# Altium schematic sheet top.SchDoc
size 420 x 297 mm; SheetNumber: 1; SheetTotal: 7
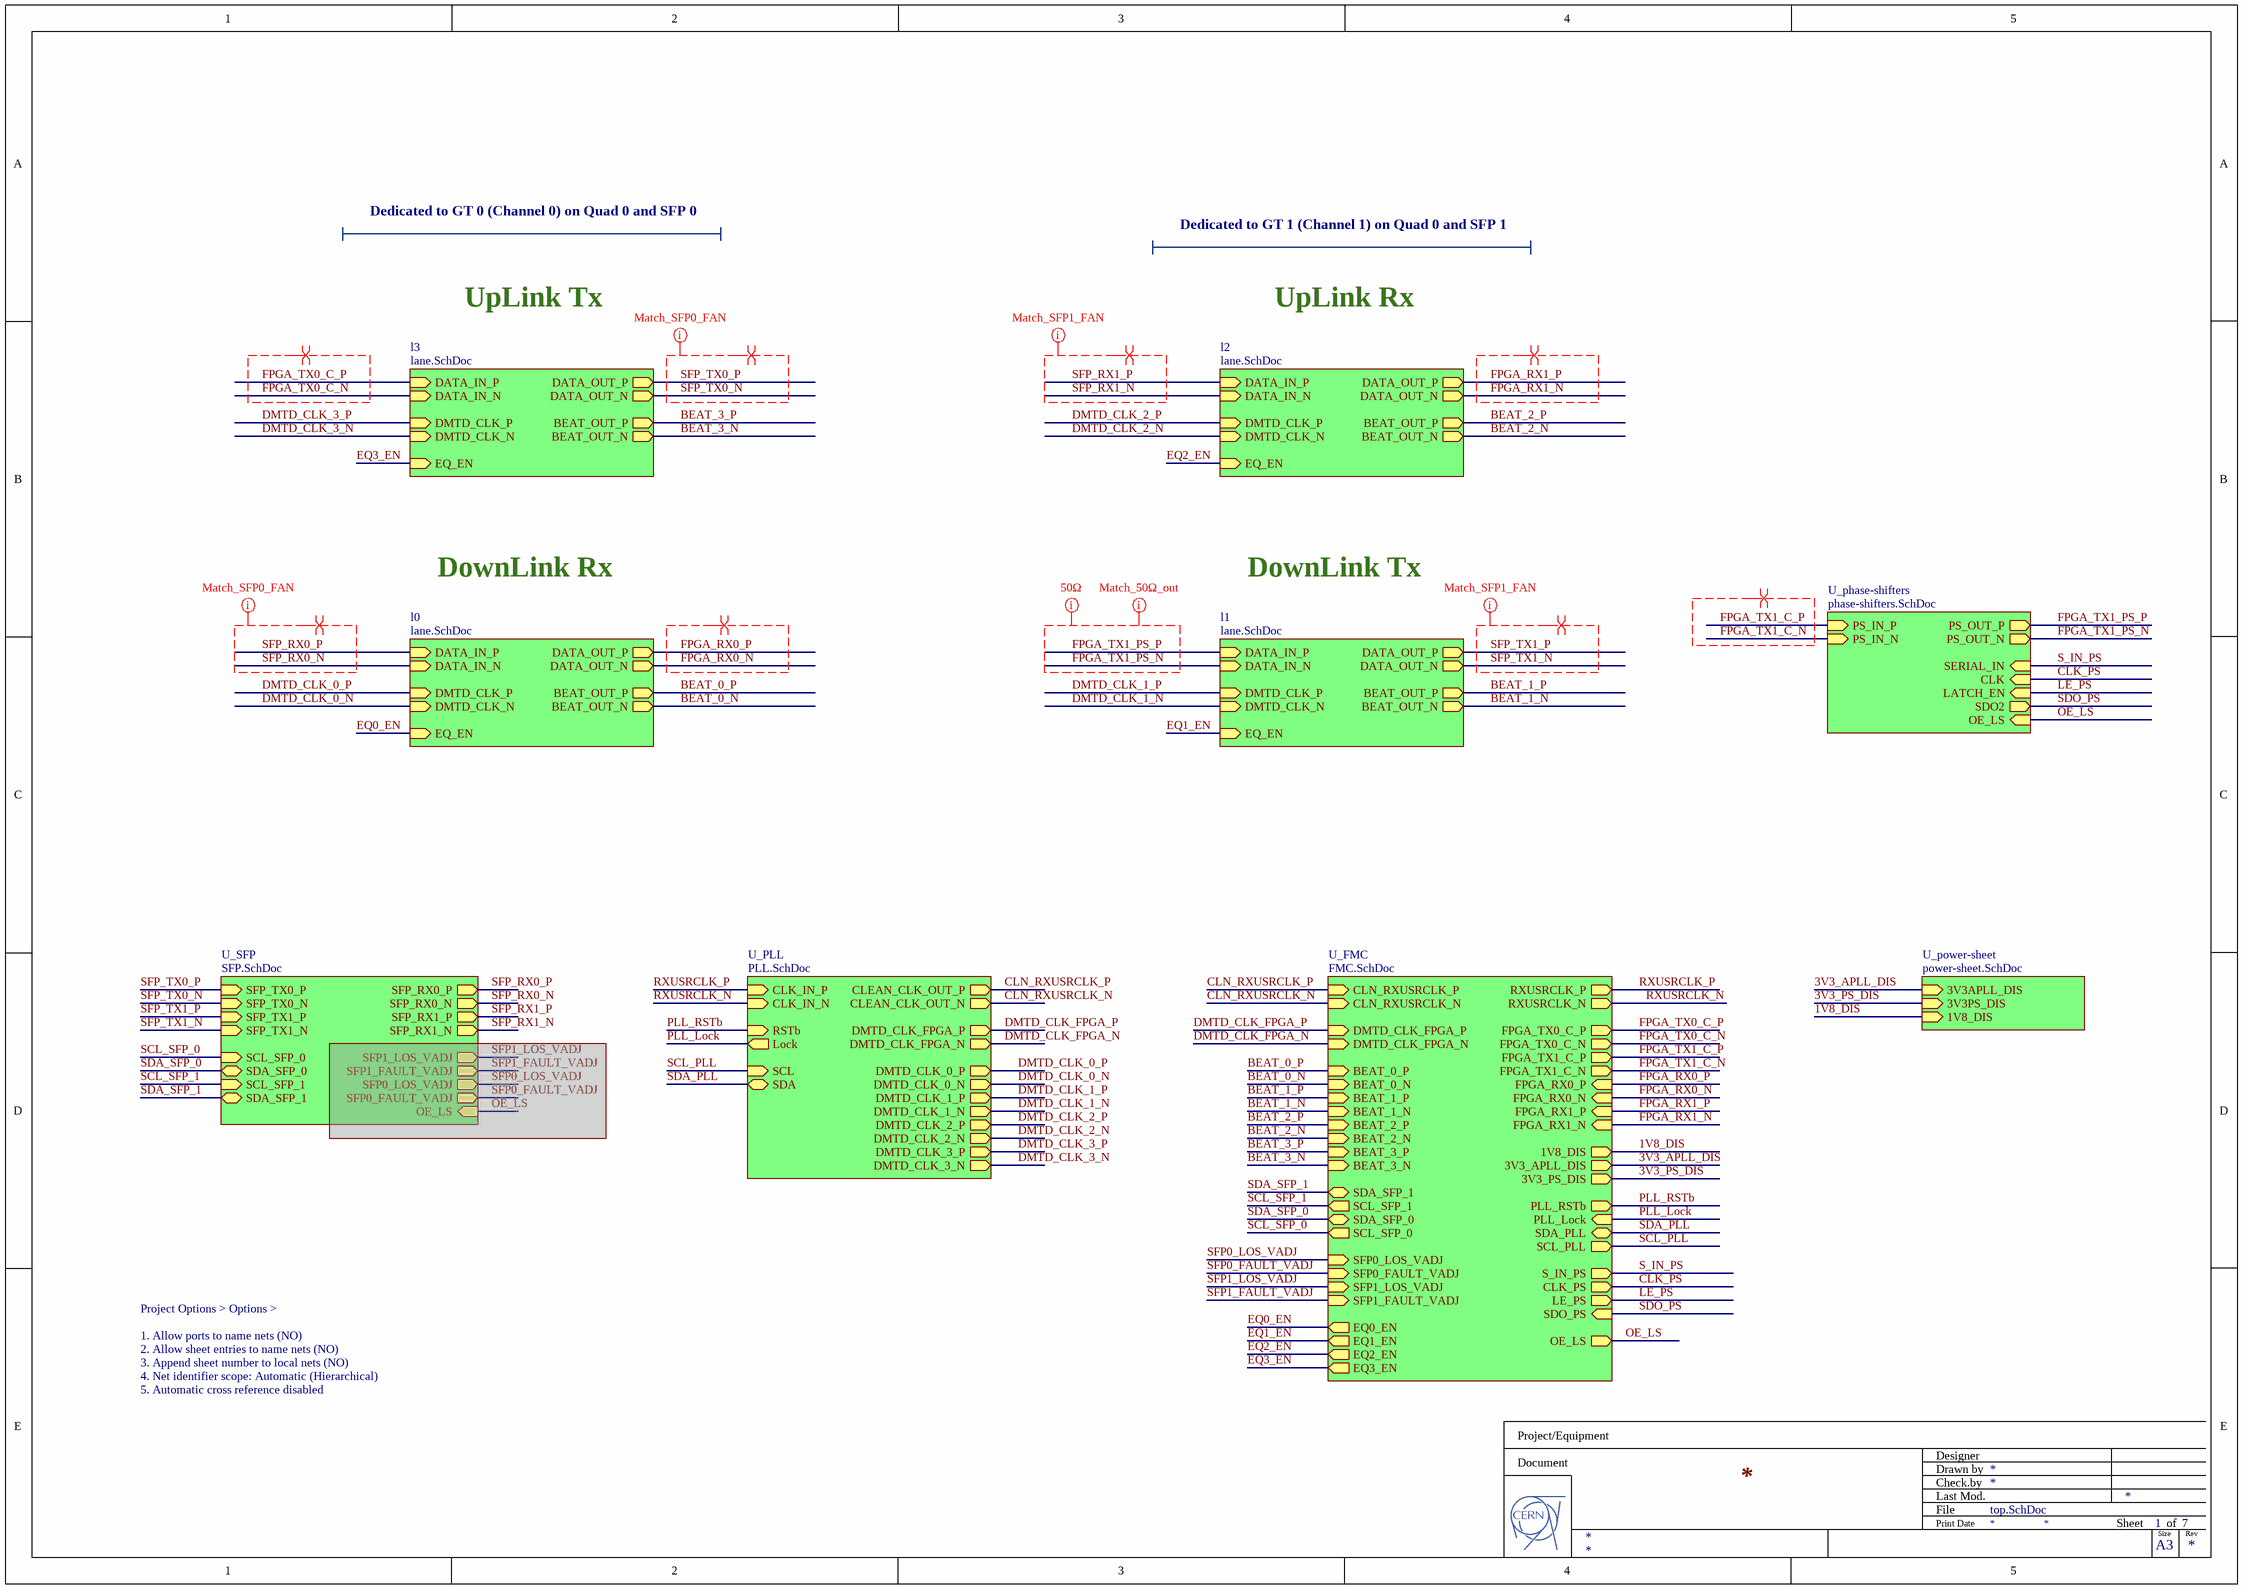
[diagram p0: top.SchDoc]

## Sub-sheets
l0 = lane.SchDoc: DATA_IN_P (in), DATA_IN_N (in), BEAT_OUT_P (out), BEAT_OUT_N (out), DMTD_CLK_P (in), DMTD_CLK_N (in), DATA_OUT_P (out), DATA_OUT_N (out), EQ_EN (in)
l1 = lane.SchDoc: DATA_IN_P (in), DATA_IN_N (in), BEAT_OUT_P (out), BEAT_OUT_N (out), DMTD_CLK_P (in), DMTD_CLK_N (in), DATA_OUT_P (out), DATA_OUT_N (out), EQ_EN (in)
l2 = lane.SchDoc: DATA_IN_P (in), DATA_IN_N (in), BEAT_OUT_P (out), BEAT_OUT_N (out), DMTD_CLK_P (in), DMTD_CLK_N (in), DATA_OUT_P (out), DATA_OUT_N (out), EQ_EN (in)
l3 = lane.SchDoc: DATA_IN_P (in), DATA_IN_N (in), BEAT_OUT_P (out), BEAT_OUT_N (out), DMTD_CLK_P (in), DMTD_CLK_N (in), DATA_OUT_P (out), DATA_OUT_N (out), EQ_EN (in)
U_FMC = FMC.SchDoc: DMTD_CLK_FPGA_N (in), DMTD_CLK_FPGA_P (in), BEAT_3_P (in), BEAT_3_N (in), SCL_PLL (out), SDA_PLL (bidir), SCL_SFP_1 (out), SDA_SFP_1 (bidir), SCL_SFP_0 (out), SDA_SFP_0 (bidir), PLL_Lock (in), SFP0_LOS_VADJ (in), SFP0_FAULT_VADJ (in), SFP1_LOS_VADJ (in), SFP1_FAULT_VADJ (in), CLN_RXUSRCLK_P (in), CLN_RXUSRCLK_N (in), RXUSRCLK_P (out), RXUSRCLK_N (out), PLL_RSTb (out), 1V8_DIS (out), 3V3_APLL_DIS (out), 3V3_PS_DIS (out), FPGA_TX0_C_P (out), FPGA_TX0_C_N (out), FPGA_TX1_C_P (out), FPGA_TX1_C_N (out), FPGA_RX0_P (in), FPGA_RX0_N (in), FPGA_RX1_P (in), FPGA_RX1_N (in), BEAT_0_P (in), BEAT_0_N (in), BEAT_1_P (in), BEAT_1_N (in), BEAT_2_P (in), BEAT_2_N (in), S_IN_PS (out), CLK_PS (out), LE_PS (out), SDO_PS (in), EQ0_EN (out), EQ1_EN (out), EQ2_EN (out), EQ3_EN (out), OE_LS (out)
U_phase-shifters = phase-shifters.SchDoc: PS_IN_P (in), PS_IN_N (in), PS_OUT_P (out), LATCH_EN (in), CLK (in), SERIAL_IN (in), SDO2 (out), PS_OUT_N (out), OE_LS (in)
U_PLL = PLL.SchDoc: SCL (in), SDA (bidir), CLK_IN_P (in), CLK_IN_N (in), CLEAN_CLK_OUT_P (out), CLEAN_CLK_OUT_N (out), DMTD_CLK_0_P (out), DMTD_CLK_0_N (out), DMTD_CLK_1_P (out), DMTD_CLK_1_N (out), DMTD_CLK_2_P (out), DMTD_CLK_2_N (out), DMTD_CLK_FPGA_P (out), DMTD_CLK_FPGA_N (out), DMTD_CLK_3_P (out), DMTD_CLK_3_N (out), Lock (out), RSTb (in)
U_power-sheet = power-sheet.SchDoc: 3V3APLL_DIS (in), 3V3PS_DIS (in), 1V8_DIS (in)
U_SFP = SFP.SchDoc: SFP_RX0_P (out), SFP_RX0_N (out), SFP_TX0_P (in), SFP_TX0_N (in), SFP_RX1_P (out), SFP_RX1_N (out), SFP_TX1_P (in), SFP_TX1_N (in), SCL_SFP_0 (in), SDA_SFP_0 (bidir), SCL_SFP_1 (in), SDA_SFP_1 (bidir), SFP1_LOS_VADJ (out), SFP1_FAULT_VADJ (out), SFP0_LOS_VADJ (out), SFP0_FAULT_VADJ (out), OE_LS (in)

## Nets
1V8_DIS: sheet U_power-sheet/1V8_DIS, sheet U_FMC/1V8_DIS
3V3_APLL_DIS: sheet U_power-sheet/3V3APLL_DIS, sheet U_FMC/3V3_APLL_DIS
3V3_PS_DIS: sheet U_power-sheet/3V3PS_DIS, sheet U_FMC/3V3_PS_DIS
BEAT_0_N: sheet l0/BEAT_OUT_N, sheet U_FMC/BEAT_0_N
BEAT_0_P: sheet l0/BEAT_OUT_P, sheet U_FMC/BEAT_0_P
BEAT_1_N: sheet l1/BEAT_OUT_N, sheet U_FMC/BEAT_1_N
BEAT_1_P: sheet l1/BEAT_OUT_P, sheet U_FMC/BEAT_1_P
BEAT_2_N: sheet l2/BEAT_OUT_N, sheet U_FMC/BEAT_2_N
BEAT_2_P: sheet l2/BEAT_OUT_P, sheet U_FMC/BEAT_2_P
BEAT_3_N: sheet l3/BEAT_OUT_N, sheet U_FMC/BEAT_3_N
BEAT_3_P: sheet l3/BEAT_OUT_P, sheet U_FMC/BEAT_3_P
CLK_PS: sheet U_FMC/CLK_PS, sheet U_phase-shifters/CLK
CLN_RXUSRCLK_N: sheet U_PLL/CLEAN_CLK_OUT_N, sheet U_FMC/CLN_RXUSRCLK_N
CLN_RXUSRCLK_P: sheet U_PLL/CLEAN_CLK_OUT_P, sheet U_FMC/CLN_RXUSRCLK_P
DMTD_CLK_0_N: sheet U_PLL/DMTD_CLK_0_N, sheet l0/DMTD_CLK_N
DMTD_CLK_0_P: sheet U_PLL/DMTD_CLK_0_P, sheet l0/DMTD_CLK_P
DMTD_CLK_1_N: sheet U_PLL/DMTD_CLK_1_N, sheet l1/DMTD_CLK_N
DMTD_CLK_1_P: sheet U_PLL/DMTD_CLK_1_P, sheet l1/DMTD_CLK_P
DMTD_CLK_2_N: sheet U_PLL/DMTD_CLK_2_N, sheet l2/DMTD_CLK_N
DMTD_CLK_2_P: sheet U_PLL/DMTD_CLK_2_P, sheet l2/DMTD_CLK_P
DMTD_CLK_3_N: sheet U_PLL/DMTD_CLK_3_N, sheet l3/DMTD_CLK_N
DMTD_CLK_3_P: sheet U_PLL/DMTD_CLK_3_P, sheet l3/DMTD_CLK_P
DMTD_CLK_FPGA_N: sheet U_PLL/DMTD_CLK_FPGA_N, sheet U_FMC/DMTD_CLK_FPGA_N
DMTD_CLK_FPGA_P: sheet U_PLL/DMTD_CLK_FPGA_P, sheet U_FMC/DMTD_CLK_FPGA_P
EQ0_EN: sheet l0/EQ_EN, sheet U_FMC/EQ0_EN
EQ1_EN: sheet l1/EQ_EN, sheet U_FMC/EQ1_EN
EQ2_EN: sheet l2/EQ_EN, sheet U_FMC/EQ2_EN
EQ3_EN: sheet l3/EQ_EN, sheet U_FMC/EQ3_EN
FPGA_RX0_N: sheet l0/DATA_OUT_N, sheet U_FMC/FPGA_RX0_N
FPGA_RX0_P: sheet l0/DATA_OUT_P, sheet U_FMC/FPGA_RX0_P
FPGA_RX1_N: sheet l2/DATA_OUT_N, sheet U_FMC/FPGA_RX1_N
FPGA_RX1_P: sheet l2/DATA_OUT_P, sheet U_FMC/FPGA_RX1_P
FPGA_TX0_C_N: sheet l3/DATA_IN_N, sheet U_FMC/FPGA_TX0_C_N
FPGA_TX0_C_P: sheet l3/DATA_IN_P, sheet U_FMC/FPGA_TX0_C_P
FPGA_TX1_C_N: sheet U_FMC/FPGA_TX1_C_N, sheet U_phase-shifters/PS_IN_N
FPGA_TX1_C_P: sheet U_FMC/FPGA_TX1_C_P, sheet U_phase-shifters/PS_IN_P
FPGA_TX1_PS_N: sheet l1/DATA_IN_N, sheet U_phase-shifters/PS_OUT_N
FPGA_TX1_PS_P: sheet l1/DATA_IN_P, sheet U_phase-shifters/PS_OUT_P
LE_PS: sheet U_FMC/LE_PS, sheet U_phase-shifters/LATCH_EN
OE_LS: sheet U_FMC/OE_LS, sheet U_phase-shifters/OE_LS
PLL_Lock: sheet U_PLL/Lock, sheet U_FMC/PLL_Lock
PLL_RSTb: sheet U_PLL/RSTb, sheet U_FMC/PLL_RSTb
RXUSRCLK_N: sheet U_PLL/CLK_IN_N, sheet U_FMC/RXUSRCLK_N
RXUSRCLK_P: sheet U_PLL/CLK_IN_P, sheet U_FMC/RXUSRCLK_P
S_IN_PS: sheet U_FMC/S_IN_PS, sheet U_phase-shifters/SERIAL_IN
SCL_PLL: sheet U_PLL/SCL, sheet U_FMC/SCL_PLL
SCL_SFP_0: sheet U_SFP/SCL_SFP_0, sheet U_FMC/SCL_SFP_0
SCL_SFP_1: sheet U_SFP/SCL_SFP_1, sheet U_FMC/SCL_SFP_1
SDA_PLL: sheet U_PLL/SDA, sheet U_FMC/SDA_PLL
SDA_SFP_0: sheet U_SFP/SDA_SFP_0, sheet U_FMC/SDA_SFP_0
SDA_SFP_1: sheet U_SFP/SDA_SFP_1, sheet U_FMC/SDA_SFP_1
SDO_PS: sheet U_FMC/SDO_PS, sheet U_phase-shifters/SDO2
SFP0_FAULT_VADJ: sheet U_FMC/SFP0_FAULT_VADJ
SFP0_LOS_VADJ: sheet U_FMC/SFP0_LOS_VADJ
SFP1_FAULT_VADJ: sheet U_FMC/SFP1_FAULT_VADJ
SFP1_LOS_VADJ: sheet U_FMC/SFP1_LOS_VADJ
SFP_RX0_N: sheet U_SFP/SFP_RX0_N, sheet l0/DATA_IN_N
SFP_RX0_P: sheet U_SFP/SFP_RX0_P, sheet l0/DATA_IN_P
SFP_RX1_N: sheet U_SFP/SFP_RX1_N, sheet l2/DATA_IN_N
SFP_RX1_P: sheet U_SFP/SFP_RX1_P, sheet l2/DATA_IN_P
SFP_TX0_N: sheet U_SFP/SFP_TX0_N, sheet l3/DATA_OUT_N
SFP_TX0_P: sheet U_SFP/SFP_TX0_P, sheet l3/DATA_OUT_P
SFP_TX1_N: sheet U_SFP/SFP_TX1_N, sheet l1/DATA_OUT_N
SFP_TX1_P: sheet U_SFP/SFP_TX1_P, sheet l1/DATA_OUT_P

## Layout directives
differential pair: FPGA_RX0_N, FPGA_RX0_P, FPGA_RX1_N, FPGA_RX1_P, FPGA_TX0_C_N, FPGA_TX0_C_P, FPGA_TX1_C_N, FPGA_TX1_C_P, SFP_RX0_N, SFP_RX0_P, SFP_RX1_N, SFP_RX1_P, SFP_TX0_N, SFP_TX0_P, SFP_TX1_N, SFP_TX1_P
net class Match_SFP0_FAN: SFP_RX0_N, SFP_RX0_P, SFP_TX0_N, SFP_TX0_P
net class Match_SFP1_FAN: SFP_RX1_N, SFP_RX1_P, SFP_TX1_N, SFP_TX1_P
net class Match_50ohm_out: FPGA_TX1_PS_N, FPGA_TX1_PS_P
net class 50ohm: FPGA_TX1_PS_N, FPGA_TX1_PS_P

## Notes on the sheet
- Dedicated to GT 0 (Channel 0) on Quad 0 and SFP 0
- Dedicated to GT 1 (Channel 1) on Quad 0 and SFP 1
- UpLink Tx
- UpLink Rx
- DownLink Rx
- DownLink Tx
- Project Options > Options >
  1. Allow ports to name nets (NO)
  2. Allow sheet entries to name nets (NO)
  3. Append sheet number to local nets (NO)
  4. Net identifier scope: Automatic (Hierarchical)
  5. Automatic cross reference disabled
- Project/Equipment
- Document
- Designer
- Drawn by
- Check.by
- File
- Last Mod.
- Print Date
- Sheet
- Size
- A3
- of
- Rev